# EAGLE schematic DaughterBoard-v0.1 (EAGLE 9.5.1)
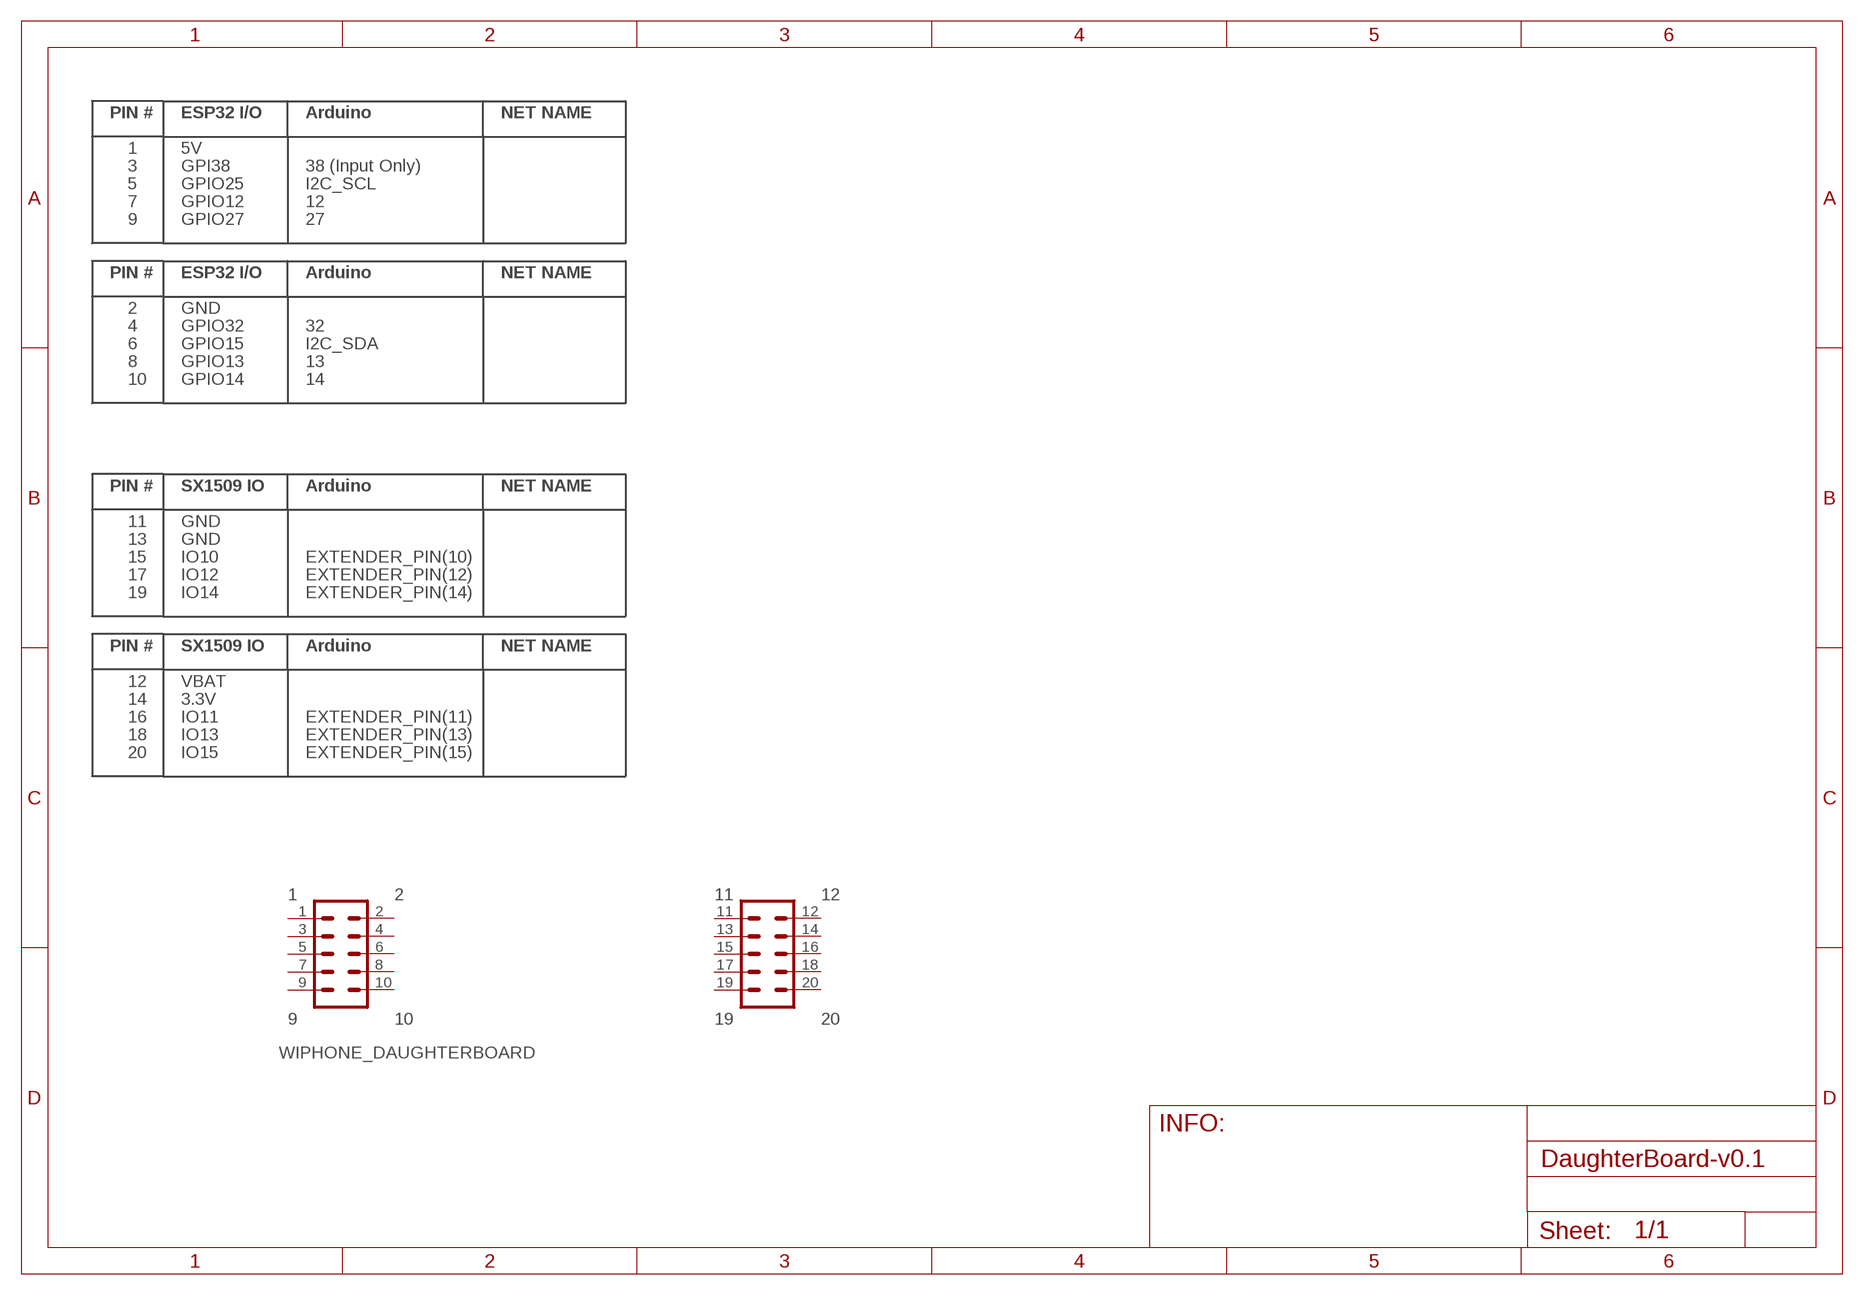
[diagram p0: schematic, sheet 1]

## Parts
WIPHONE_DAUGHTERBOARD-FOOTPRINT1  WIPHONE_DAUGHTERBOARD  [WIPHONE_DAUGHTERBOARD-NLOGO]
Unconnected: WIPHONE_DAUGHTERBOARD-FOOTPRINT1.3 WIPHONE_DAUGHTERBOARD-FOOTPRINT1.4 WIPHONE_DAUGHTERBOARD-FOOTPRINT1.5 WIPHONE_DAUGHTERBOARD-FOOTPRINT1.6 WIPHONE_DAUGHTERBOARD-FOOTPRINT1.7 WIPHONE_DAUGHTERBOARD-FOOTPRINT1.8 WIPHONE_DAUGHTERBOARD-FOOTPRINT1.9 WIPHONE_DAUGHTERBOARD-FOOTPRINT1.10 WIPHONE_DAUGHTERBOARD-FOOTPRINT1.15 WIPHONE_DAUGHTERBOARD-FOOTPRINT1.16 WIPHONE_DAUGHTERBOARD-FOOTPRINT1.17 WIPHONE_DAUGHTERBOARD-FOOTPRINT1.18 WIPHONE_DAUGHTERBOARD-FOOTPRINT1.19 WIPHONE_DAUGHTERBOARD-FOOTPRINT1.20

## Power pins joined to a net without a drawn wire
1: WIPHONE_DAUGHTERBOARD-FOOTPRINT1.1
2: WIPHONE_DAUGHTERBOARD-FOOTPRINT1.2
11: WIPHONE_DAUGHTERBOARD-FOOTPRINT1.11
12: WIPHONE_DAUGHTERBOARD-FOOTPRINT1.12
13: WIPHONE_DAUGHTERBOARD-FOOTPRINT1.13
14: WIPHONE_DAUGHTERBOARD-FOOTPRINT1.14

## Library data of the parts
WIPHONE_DAUGHTERBOARD-FOOTPRINT1 = DaughterBoard Footprint-v0.1:WIPHONE_DAUGHTERBOARD